# Altium schematic sheet Schematic_Phat.SchDoc
size A; PageSetup: Record=PageOptions|CenterHorizontal=True|CenterVertical=True|PrintScale=1.09|XCorrection=1.00|YCorrection=1.00|PrintKind=2|BorderSize=5000000|LeftOffset=0|BottomOffset=0|Orientation=2|PaperLength=1000|PaperWidth=1000|Scale=100|PaperSource=7|PrintQuality=-3|MediaType=1|DitherType=10|PrintScaleMode=1|PaperKind=A4|PaperIndex=9
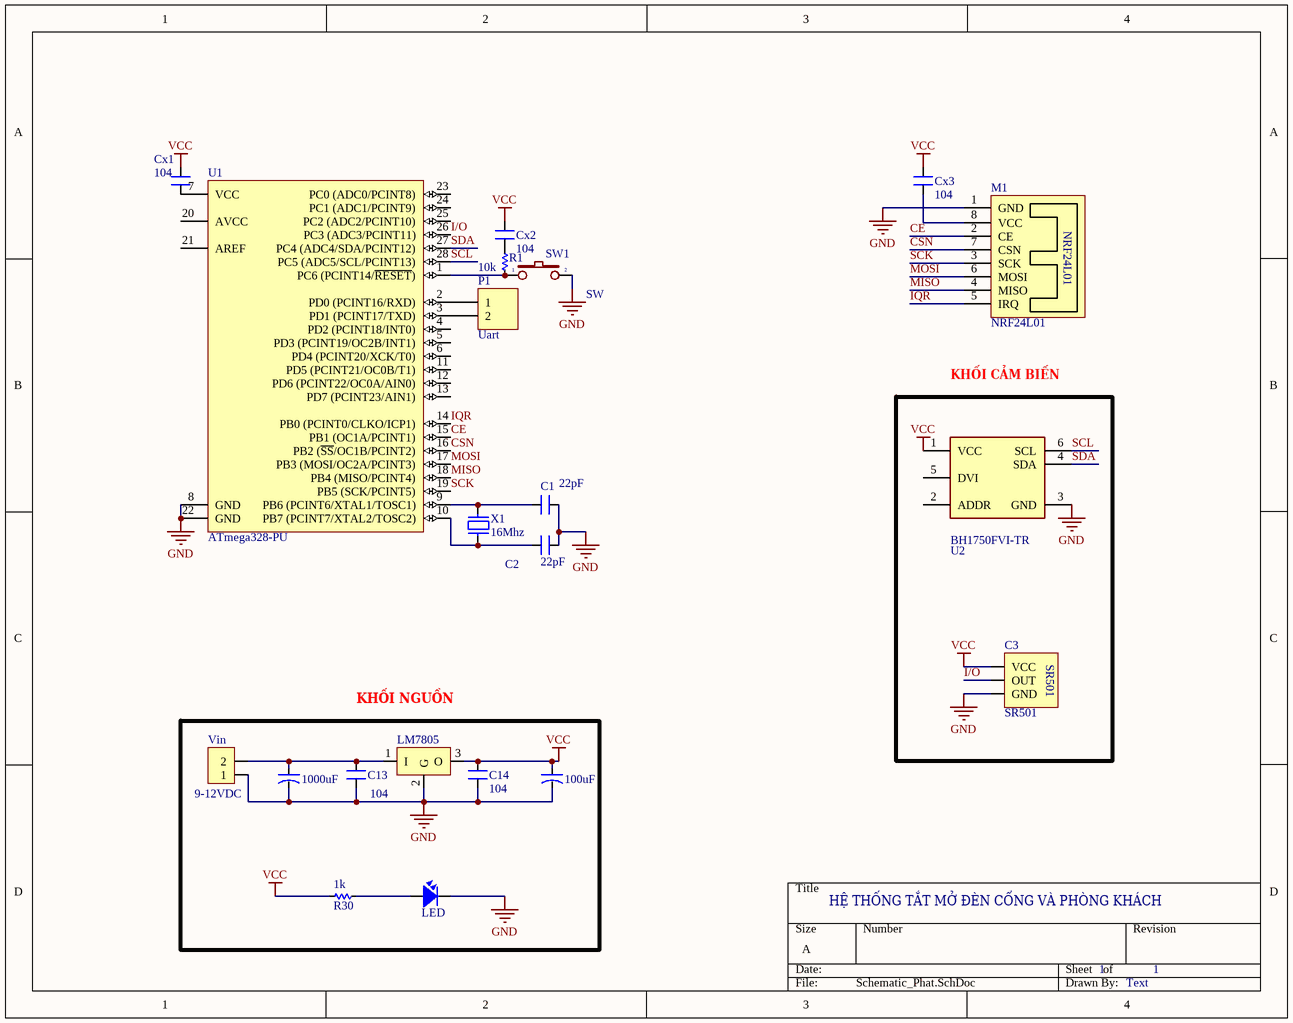
[diagram p0: Schematic_Phat.SchDoc]

## Parts
1k  R30  [RES-1/2W]
100uF  CN-ALU-DIP  [CA-ALU-2.54]  (value not drawn)
1000uF  CN-ALU-DIP  [CA-ALU-2.54]  (value not drawn)
C1  22pF  [CN1.5]
C2  22pF  [CN1.5]
C3  SR501  [SR501]
C13  104  [CN1.5]
C14  104  [CN1.5]
Cx1  104  [CN-SMD-0805]
Cx2  104  [CN-SMD-0805]
Cx3  104  [CN-SMD-0805]
LED  LED  [LED-3MM-RED]  (value not drawn)
LM7805  LM78xx  [TO220-123]  (value not drawn)
M1  NRF24L01  [NRF24L01]
P1  Uart  [HDR1X2]
R1  10k  [RES-1/2W]
SW1  SW  [SW1-DIP]
U1  ATmega328-PU  [DIP28]
U2  BH1750FVI-TR  [ROHM_BH1750FVI-TR_0]  (value not drawn)
Vin  9-12VDC  [Header2]
X1  16Mhz  [XT2]

## Blocks framed on the sheet
KHỐI CẢM BIẾN: C3 U2
KHỐI NGUỒN: 1k 100uF 1000uF C13 C14 LED LM7805 Vin

## Nets
GND: 100uF.2 1000uF.2 C1.2 C2.2 C3.3(GND) C13.2 C14.1 LED.2 LM7805.2(G) M1.1(GND) SW1.2 U1.8(GND) U1.22(GND) U2.3(GND) Vin.1
VCC: 1k.2 100uF.1 C3.1(VCC) C14.2 Cx1.2 Cx2.2 Cx3.2 LM7805.3(O) U2.1(VCC)
CE: M1.2(CE) U1.15(PB1_(OC1A/PCINT1))
CSN: M1.7(CSN) U1.16(PB2_(~{SS}/OC1B/PCINT2))
I/O: C3.2(OUT) U1.26(PC3_(ADC3/PCINT11))
IQR: M1.5(IRQ) U1.14(PB0_(PCINT0/CLKO/ICP1))
MISO: M1.4(MISO) U1.18(PB4_(MISO/PCINT4))
MOSI: M1.6(MOSI) U1.17(PB3_(MOSI/OC2A/PCINT3))
SCK: M1.3(SCK) U1.19(PB5_(SCK/PCINT5))
SCL: U1.28(PC5_(ADC5/SCL/PCINT13)) U2.6(SCL)
SDA: U1.27(PC4_(ADC4/SDA/PCINT12)) U2.4(SDA)
Net1k_1: 1k.1 LED.1
Net1000uF_1: 1000uF.1 C13.1 LM7805.1(I) Vin.2
NetC1_1: C1.1 U1.9(PB6_(PCINT6/XTAL1/TOSC1)) X1.2
NetC2_1: C2.1 U1.10(PB7_(PCINT7/XTAL2/TOSC2)) X1.1
NetCx1_1: Cx1.1 U1.7(VCC)
NetCx2_1: Cx2.1 R1.2
NetCx3_1: Cx3.1 M1.8(VCC)
NetP1_1: P1.1 U1.2(PD0_(PCINT16/RXD))
NetP1_2: P1.2 U1.3(PD1_(PCINT17/TXD))
NetR1_1: R1.1 SW1.1 U1.1(PC6_(PCINT14/~{RESET}))

Not connected (* = marked no-connect by the designer): U1 4(PD2_(PCINT18/INT0)) 5(PD3_(PCINT19/OC2B/INT1)) 6(PD4_(PCINT20/XCK/T0)) 11(PD5_(PCINT21/OC0B/T1)) 12(PD6_(PCINT22/OC0A/AIN0)) 13(PD7_(PCINT23/AIN1)) 20(AVCC) 21(AREF) 23(PC0_(ADC0/PCINT8)) 24(PC1_(ADC1/PCINT9)) 25(PC2_(ADC2/PCINT10)); U2 2(ADDR) 5(DVI)

## Notes on the sheet
- HỆ THỐNG TẮT MỞ ĐÈN CỔNG VÀ PHÒNG KHÁCH
- 1
- Text

## Library data of the parts
1k R1 = Res: Manufacturer: Generic Components; Class: Passive; SubClass: R; Published: 08/06/2000; Publisher: Altium Hobart Technology Centre
100uF 1000uF = CN-ALU-DIP: Capacitor (Semiconductor SIM Model); Value: 104; LatestRevisionDate: 17-Jul-2002; LatestRevisionNote: Re-released for DXP Platform.; PackageReference: C1206; Publisher: Altium Limited
C1 C2 C13 C14 Cx1-Cx3 = CN: Value: 33pF
C3 = SR501: Manufacturer: W¨¹rth Elektronik eiSos GmbH; partNo: 613003143121; ComponentLink1 Description: Manufacturer; ComponentLink2 Description: Datasheet; NoPins: 03; Created Date: 29 March 2013; ComponentLink1URL: http://www.we-online.com; ComponentLink2URL: http://katalog.we-online.de/em/datasheet/6130xx143121.pdf; Created by: Karrer Zheng
LED = LED: LED Single colour Green and Red; Value: LED 3 ly Single Colour
LM7805 = LM78xx: Positive Voltage Regulator; Note: Tab is connected to pin 3 (GND).; Published: 24-Aug-2001; LatestRevisionDate: 17-Jul-2002; LatestRevisionNote: Re-released for DXP Platform.; DatasheetVersion: Apr-1994; PackageVersion: Jul-1998; PackageReference: ISOWATT220AB; Publisher: Altium Limited; PackageDescription: TO, Thru-Hole, Vertical, Heatsink Mounted; 3 In-Line Leads; Pitch 2.54 mm; Pin sequence 1, 3, 2; ComponentLink1Description: Manufacturer Link; ComponentLink1URL: http://www.st.com/; ComponentLink2Description: Datasheet; ComponentLink2URL: http://www.st.com/stonline/products/literature/ds/2146/l78m05c.pdf
P1 = Header 2: Header, 2-Pin; LatestRevisionDate: 17-Jul-2002; LatestRevisionNote: Re-released for DXP Platform.; Publisher: Altium Limited
SW1 = SW2: Switch button 2 pin; Value: SW chip 2 pin
U1 = ATmega328-PU: 8-bit AVR Microcontroller, 32KB Flash, 1KB EEPROM, 2KB SRAM, 28-pin PDIP, Industrial Grade (-40°C to 85°C); Published: 1-Apr-2010; DatasheetVersion: revA, Jan-2010; PackageVersion: revB, Sep-2001; PackageReference: 28P3; Publisher: Altium Limited; PackageDescription: 28-lead (0.300"/7.62mm Wide) Plastic Dual Inline Package (PDIP); Supplier 1: Digi-Key; Supplier Part Number 1: ATMEGA328-PU-ND; Supplier 2: Mouser; Supplier Part Number 2: 556-ATMEGA328-PU; ComponentLink1Description: Manufacturer Link; ComponentLink1URL: http://www.atmel.com/products/avr/default.asp?; ComponentLink2Description: ATmega48A/48PA/88A/88PA/168A/168PA/328/328P Datasheet; ComponentLink2URL: http://www.atmel.com/dyn/resources/prod_documents/8271.pdf; ComponentLink3Description: ATmega48A/48PA/88A/88PA/168A/168PA/328/328P Summary; ComponentLink3URL: http://www.atmel.com/dyn/resources/prod_documents/8271S.pdf; ComponentLink4Description: Atmel.com Home; ComponentLink4URL: http://www.atmel.com
U2 = BH1750FVI-TR: IC AMBIENT LIGHT SENSOR WSOF6; Manufacturer: ROHM; Capacitance: SKIP; Library Path1: parts/IC_ROHM_BH1750FVI-TR_eec.SchLib; Value: SKIP; Voltage: 3.6V; Part Number: BH1750FVI-TR; Datasheet Path: datasheets/IC_ROHM_BH1750FVI-TR_eec.pdf; ComponentLink1Description: Upverter; ComponentLink1URL: https://upverter.com/upn/revision/5d7ac16c7b9f1566/; ComponentLink2Description: Datasheet; ComponentLink2URL: https://www.mouser.com/catalog/specsheets/Rohm_11162017_ROHMS34826-1.pdf; Datasheet Path1: datasheets/IC_ROHM_BH1750FVI-TR_eec.pdf; Digikey Description: IC AMBIENT LIGHT SENSOR WSOF6; Digikey Part Number: BH1750FVICT-ND; Inductance: SKIP; Lead Free: yes; Library Ref1: BH1750FVI-TR; Mouser Part Number: 755-BH1750FVI-TR; Package: WSOF6I; Price: 2.5123515841; Resistance: SKIP; RoHS: TRUE; Supplier 1: Digi-Key; Supplier 2: Mouser; Supplier Part Number 1: BH1750FVICT-ND; Supplier Part Number 2: 755-BH1750FVI-TR; Temperature: -40°C to +85°C; Temperature Range High: +85°C; Temperature Range Low: -40°C; helpURL: https://upverter.com/upn/revision/5d7ac16c7b9f1566/
Vin = Header2: Header IDC, 2 x 1 Pin Vertical 2.54mm Pitch (Non-Boxed, Male); Manufacturer: W¨¹rth Elektronik eiSos GmbH; partNo: 613002143121; ComponentLink1 Description: Manufacturer; ComponentLink2 Description: Datasheet; NoPins: 02; Created Date: 29 March 2013; ComponentLink1URL: http://www.we-online.com; ComponentLink2URL: http://katalog.we-online.de/em/datasheet/6130xx143121.pdf; Created by: Karrer Zheng
X1 = XT2: Crystal, 32.768 KHz, -40 to 85 degC, 3.2 x 1.5 x 0.9 mm SMD; Value: 4Mhz